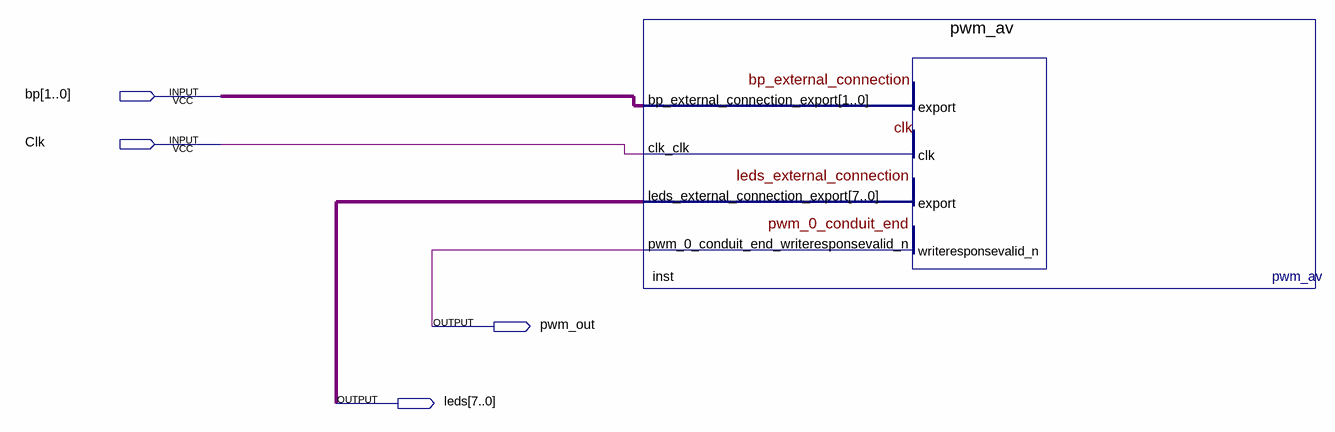
[diagram p0: schematic sheet]
// Quartus schematic pwm_avalon.bdf as structural Verilog: 1 symbols, 4 pins
module pwm_avalon (
  input  [1:0] bp,
  input  Clk,
  output pwm_out,
  output [7:0] leds
);

  pwm_av inst (
    .bp_external_connection_export(bp), .clk_clk(Clk), .leds_external_connection_export(leds),
    .pwm_0_conduit_end_writeresponsevalid_n(pwm_out));
endmodule
